# Altium schematic sheet FPGA_Quatro_SCH_main.SchDoc
size A3
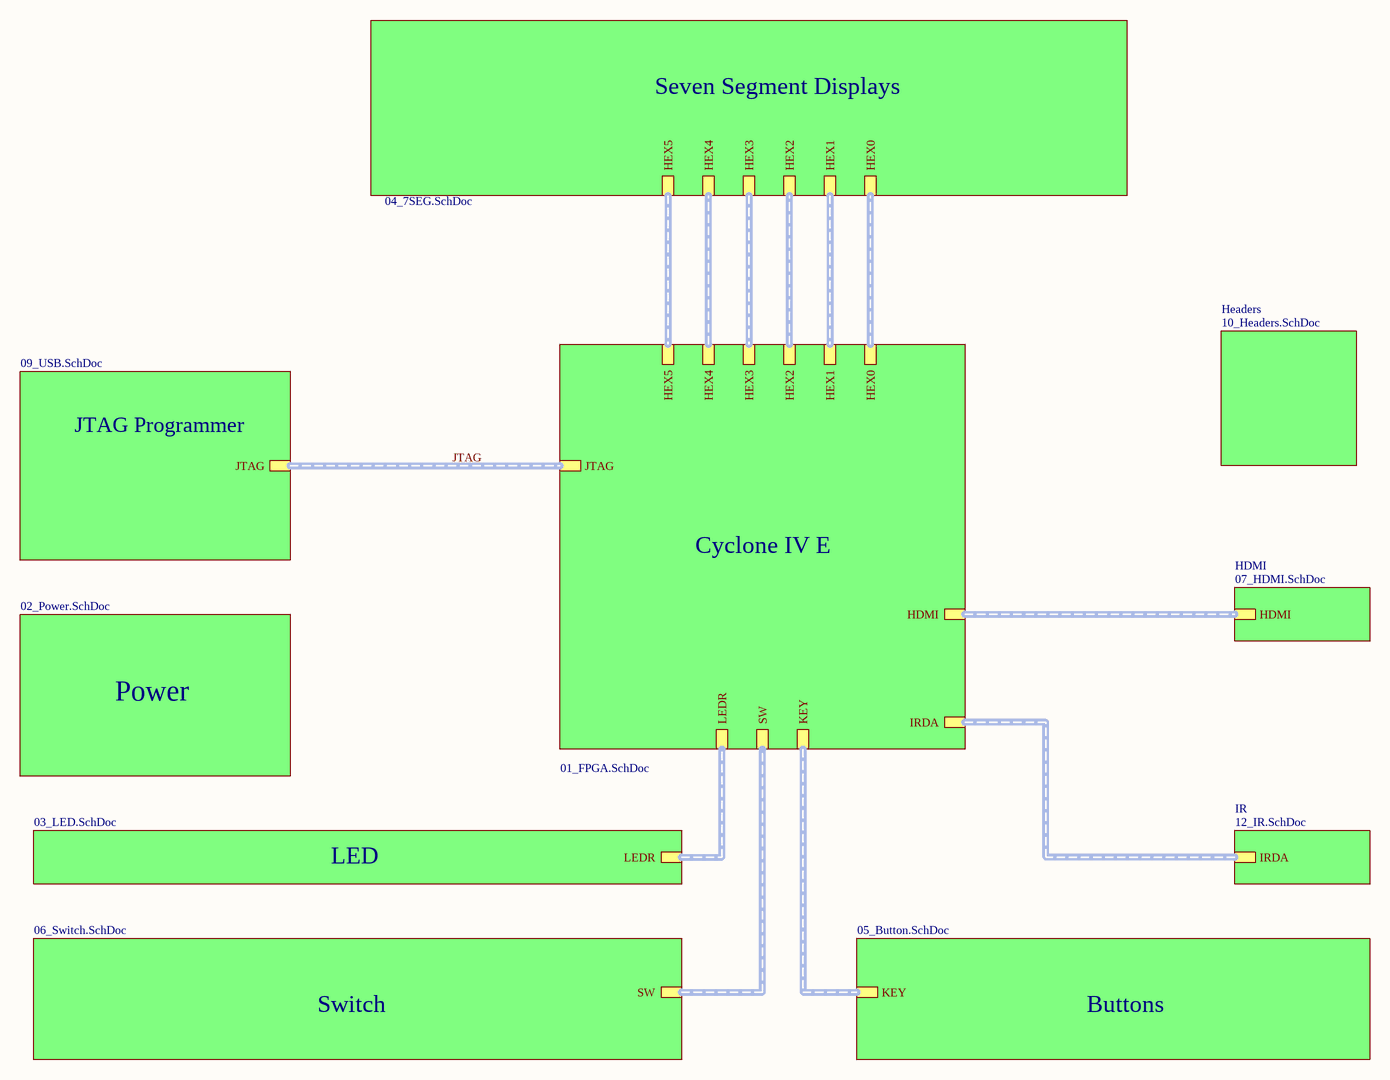
[diagram p0: FPGA_Quatro_SCH_main.SchDoc]

## Sub-sheets
Buttons = 05_Button.SchDoc: KEY (harness KEY)
Cyclone IV E = 01_FPGA.SchDoc: JTAG (harness JTAG), LEDR (harness LEDR), SW (harness SW), KEY (harness KEY), HEX4 (harness HEX4), HEX3 (harness HEX3), HEX2 (harness HEX2), HEX0 (harness HEX0), HEX5 (harness HEX5), HEX1 (harness HEX1), HDMI (harness HDMI), IRDA (harness IRDA)
HDMI = 07_HDMI.SchDoc: HDMI (harness HDMI)
Headers = 10_Headers.SchDoc: no entries
IR = 12_IR.SchDoc: IRDA (harness IRDA)
JTAG Programmer = 09_USB.SchDoc: JTAG (harness JTAG)
LED = 03_LED.SchDoc: LEDR (harness LEDR)
Power = 02_Power.SchDoc: no entries
Seven Segment Displays = 04_7SEG.SchDoc: HEX3 (harness HEX3), HEX1 (harness HEX1), HEX0 (harness HEX0), HEX2 (harness HEX2), HEX4 (harness HEX4), HEX5 (harness HEX5)
Switch = 06_Switch.SchDoc: SW (harness SW)

## Buses and harness runs
harness JTAG = sheet Cyclone IV E/JTAG = sheet JTAG Programmer/JTAG
harness sheet Buttons/KEY = sheet Cyclone IV E/KEY
harness sheet Cyclone IV E/HDMI = sheet HDMI/HDMI
harness sheet Cyclone IV E/HEX0 = sheet Seven Segment Displays/HEX0
harness sheet Cyclone IV E/HEX1 = sheet Seven Segment Displays/HEX1
harness sheet Cyclone IV E/HEX2 = sheet Seven Segment Displays/HEX2
harness sheet Cyclone IV E/HEX3 = sheet Seven Segment Displays/HEX3
harness sheet Cyclone IV E/HEX4 = sheet Seven Segment Displays/HEX4
harness sheet Cyclone IV E/HEX5 = sheet Seven Segment Displays/HEX5
harness sheet Cyclone IV E/IRDA = sheet IR/IRDA
harness sheet Cyclone IV E/LEDR = sheet LED/LEDR
harness sheet Cyclone IV E/SW = sheet Switch/SW